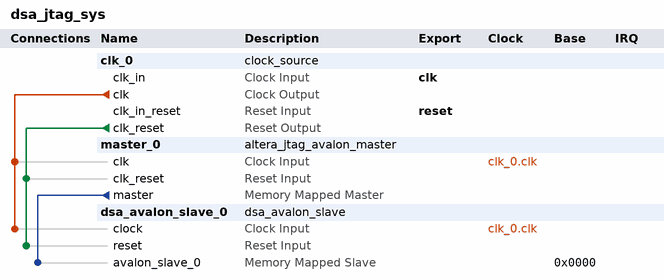
[diagram p0: system contents]
# Platform Designer (Qsys) system dsa_jtag_sys, Cyclone V 5CSEMA5F31C6
# Parameters at their usual value, and those the tool derives, are not listed.
package require -exact qsys 25.1
create_system dsa_jtag_sys
set_project_property DEVICE_FAMILY {Cyclone V}
set_project_property DEVICE 5CSEMA5F31C6

add_instance clk_0 clock_source 25.1
set_instance_parameter_value clk_0 clockFrequency 50000000

add_instance master_0 altera_jtag_avalon_master 25.1

add_instance dsa_avalon_slave_0 dsa_avalon_slave 1.0
set_instance_parameter_value dsa_avalon_slave_0 ADDR_WIDTH 16

# connections
add_connection clk_0.clk dsa_avalon_slave_0.clock clock
add_connection clk_0.clk master_0.clk clock
add_connection clk_0.clk_reset dsa_avalon_slave_0.reset reset
add_connection clk_0.clk_reset master_0.clk_reset reset
add_connection master_0.master dsa_avalon_slave_0.avalon_slave_0 avalon
set_connection_parameter_value master_0.master/dsa_avalon_slave_0.avalon_slave_0 baseAddress 0x0000

# exported interfaces
add_interface clk clock sink
set_interface_property clk EXPORT_OF clk_0.clk_in
add_interface reset reset sink
set_interface_property reset EXPORT_OF clk_0.clk_in_reset

set_interconnect_requirement {$system} qsys_mm.clockCrossingAdapter HANDSHAKE
set_interconnect_requirement {$system} qsys_mm.enableEccProtection FALSE
set_interconnect_requirement {$system} qsys_mm.insertDefaultSlave FALSE
set_interconnect_requirement {$system} qsys_mm.maxAdditionalLatency 1

save_system dsa_jtag_sys.qsys
